# EAGLE schematic Placa de Interface (EAGLE 5.06)
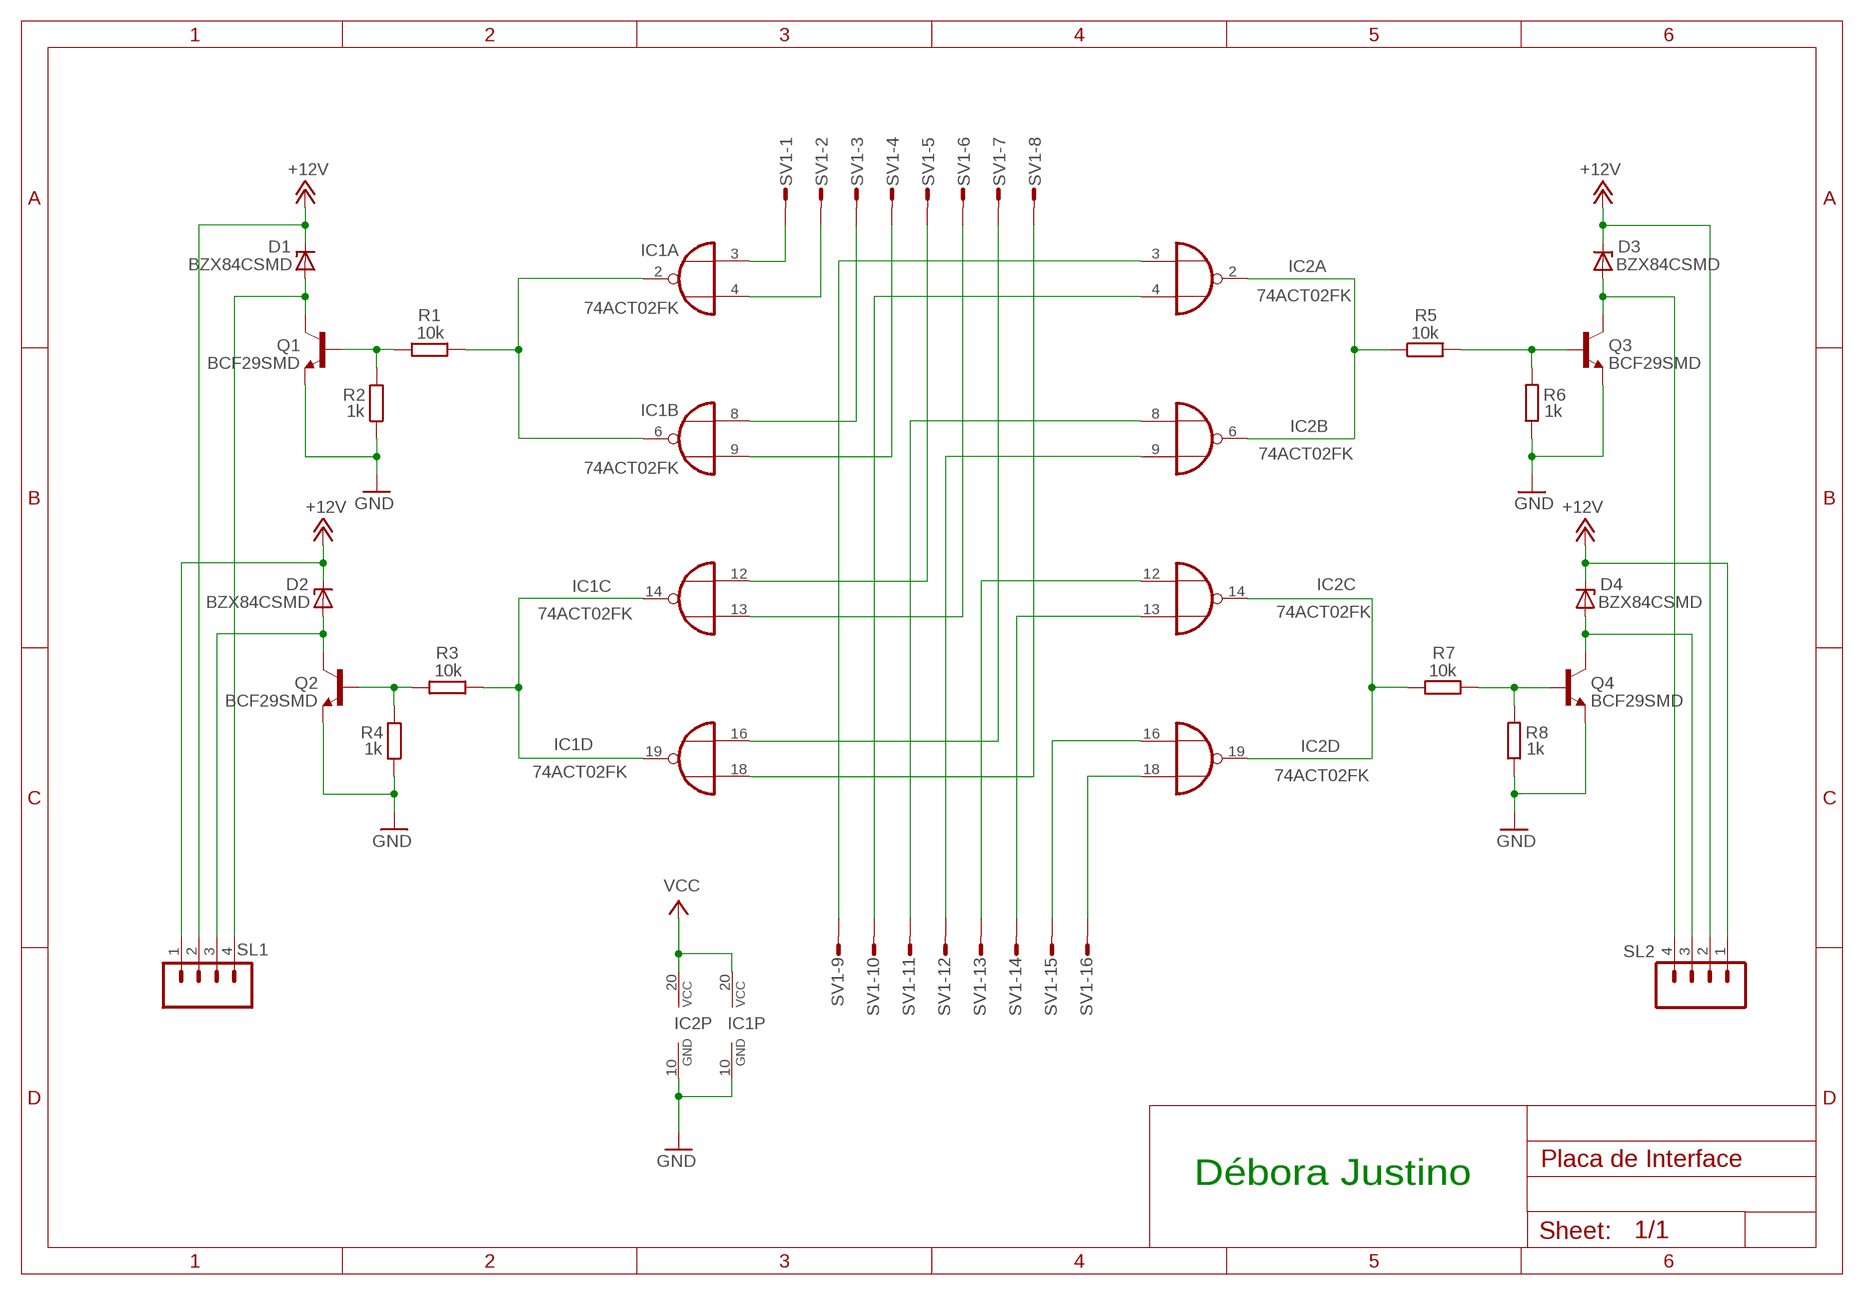
[diagram p0: schematic, sheet 1]

## Parts
D1  BZX84CSMD  [TO236]
D2  BZX84CSMD  [TO236]
D3  BZX84CSMD  [TO236]
D4  BZX84CSMD  [TO236]
IC1  74ACT02FK  [LCC20]
IC2  74ACT02FK  [LCC20]
Q1  BCF29SMD  [SOT23-BEC]
Q2  BCF29SMD  [SOT23-BEC]
Q3  BCF29SMD  [SOT23-BEC]
Q4  BCF29SMD  [SOT23-BEC]
R1  10k  R-EU_M1206  [M1206]
R2  1k  R-EU_M1206  [M1206]
R3  10k  R-EU_M1206  [M1206]
R4  1k  R-EU_M1206  [M1206]
R5  10k  R-EU_M1206  [M1206]
R6  1k  R-EU_M1206  [M1206]
R7  10k  R-EU_M1206  [M1206]
R8  1k  R-EU_M1206  [M1206]
SL1  M04  [04P]
SL2  M04  [04P]
SV1  L16P  [L16P]

## Nets
+12V: D1.C D2.C D3.C D4.C SL1.1 SL1.2 SL2.1 SL2.2
GND: IC1.10(P:GND) IC2.10(P:GND) Q1.E Q2.E Q3.E Q4.E R2.1 R4.1 R6.1 R8.1
N$1: Q1.B R1.2 R2.2
N$3: D1.A Q1.C SL1.4
N$4: Q2.B R3.2 R4.2
N$5: D2.A Q2.C SL1.3
N$6: IC1.2(A:O) IC1.6(B:O) R1.1
N$7: IC1.14(C:O) IC1.19(D:O) R3.1
N$11: Q3.B R5.2 R6.2
N$12: D3.A Q3.C SL2.4
N$13: Q4.B R7.2 R8.2
N$14: D4.A Q4.C SL2.3
N$19: IC2.14(C:O) IC2.19(D:O) R7.1
N$20: IC2.2(A:O) IC2.6(B:O) R5.1
N$21: IC1.3(A:I0) SV1.1
N$22: IC1.4(A:I1) SV1.2
N$23: IC1.8(B:I0) SV1.3
N$24: IC1.9(B:I1) SV1.4
N$25: IC1.12(C:I0) SV1.5
N$26: IC1.13(C:I1) SV1.6
N$27: IC1.16(D:I0) SV1.7
N$28: IC1.18(D:I1) SV1.8
N$29: IC2.18(D:I1) SV1.16
N$30: IC2.16(D:I0) SV1.15
N$31: IC2.13(C:I1) SV1.14
N$32: IC2.12(C:I0) SV1.13
N$33: IC2.9(B:I1) SV1.12
N$34: IC2.8(B:I0) SV1.11
N$35: IC2.4(A:I1) SV1.10
N$36: IC2.3(A:I0) SV1.9
VCC: IC1.20(P:VCC) IC2.20(P:VCC)

## Notes on the sheet
- Débora Justino

## Library data of the parts
D1-D4 = diode:BZX84CSMD: Z DIODE
IC1 IC2 = 74xx-eu:74*02: Quad 2-input NOR gate
Q1-Q4 = transistor-npn:BCF29*: NPN Transistor
R1-R8 = rcl:R-EU_: RESISTOR, European symbol
SL1 SL2 = con-amp-quick:M04: AMP QUICK CONNECTOR
SV1 = con-amp-mt:L16P: AMP MT CONNECTOR